# EAGLE design MaUWB DSTO v1.0 (EAGLE 6.1)
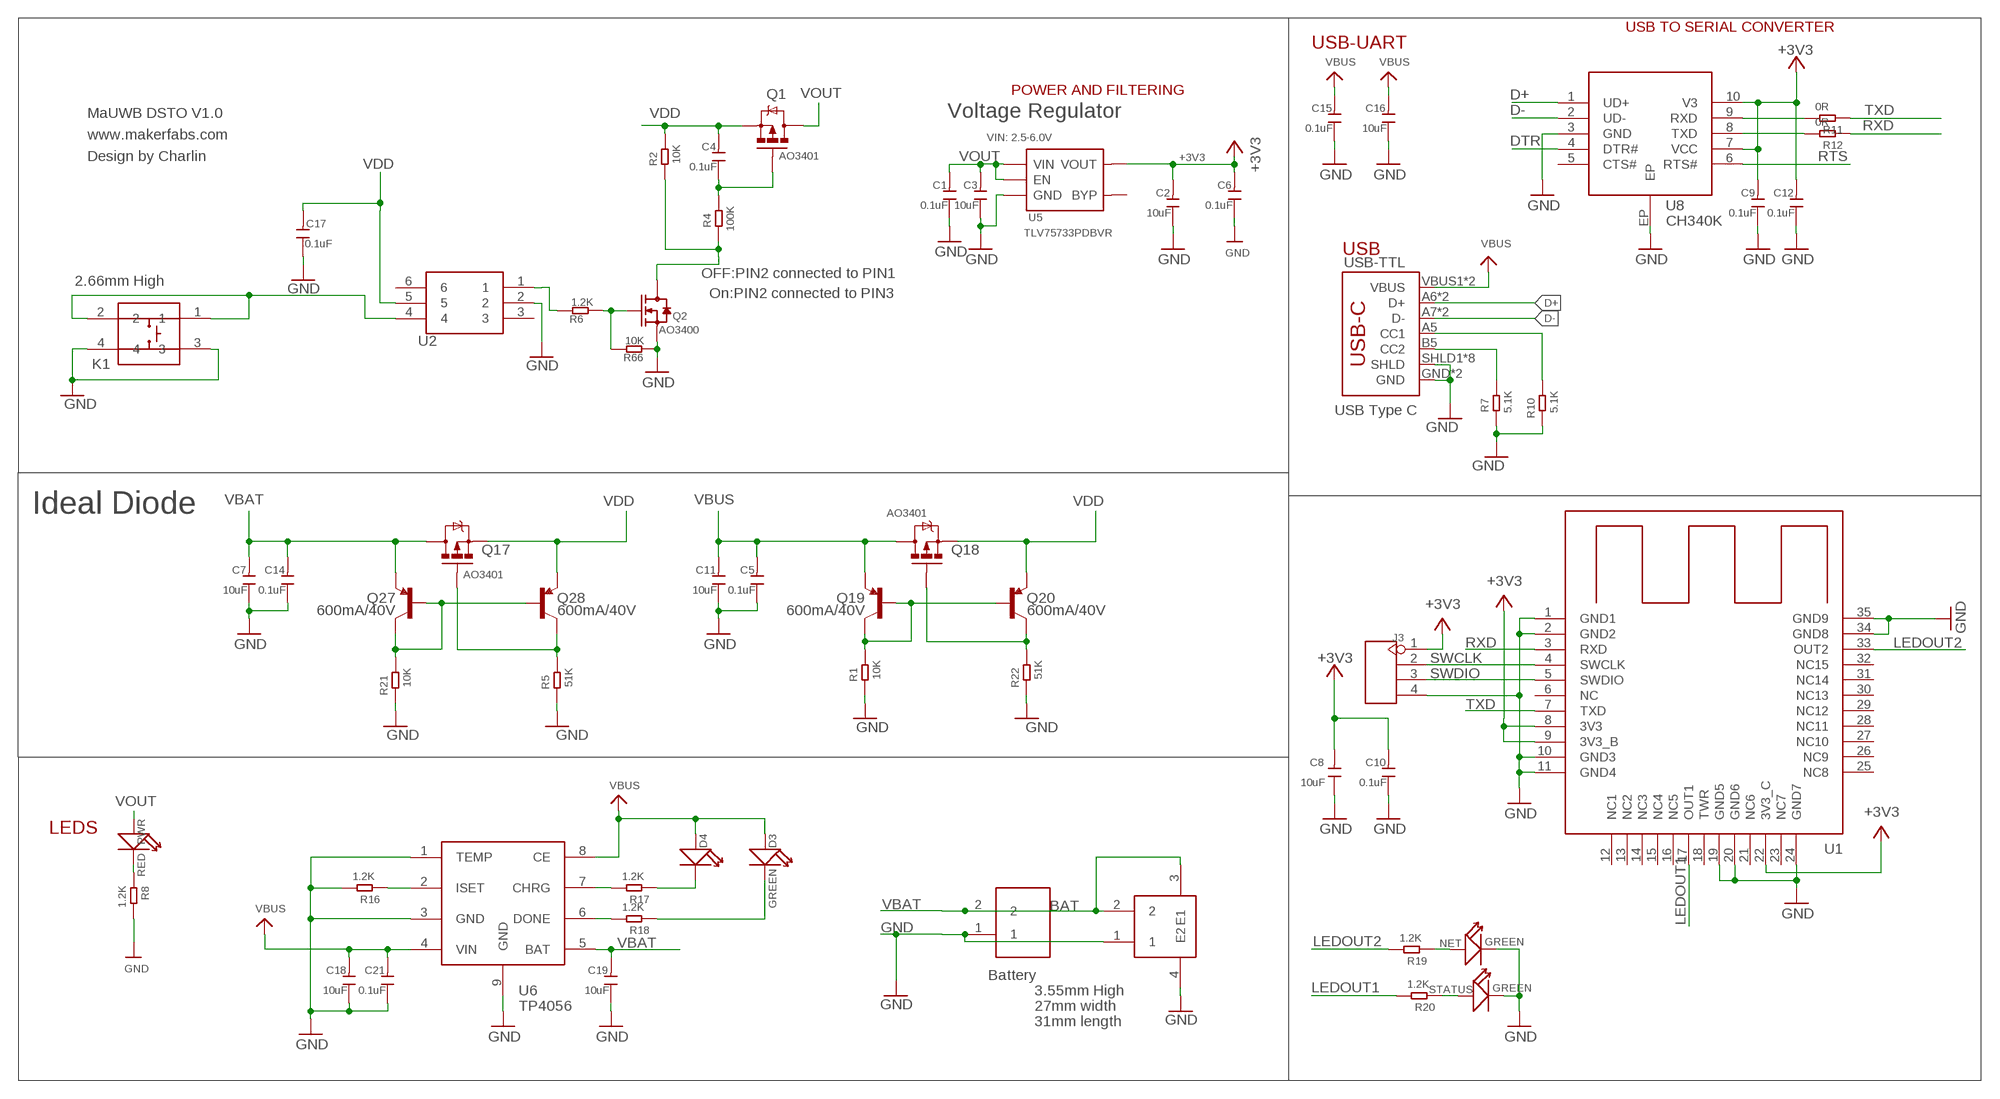
[diagram p0: schematic, sheet 1]

## Parts
BAT  PH2.0-2P-90-DIP  [PH2.0-2P-90-DIP]
C1  0.1uF  DISCRETE_C-0402  [DISCRETE_C0402]
C2  10uF  DISCRETE_C-0402  [DISCRETE_C0402]
C3  10uF  DISCRETE_C-0402  [DISCRETE_C0402]
C4  0.1uF  DISCRETE_C-0402  [DISCRETE_C0402]
C5  0.1uF  DISCRETE_C-0402  [DISCRETE_C0402]
C6  0.1uF  DISCRETE_C-0402  [DISCRETE_C0402]
C7  10uF  DISCRETE_C-0402  [DISCRETE_C0402]
C8  10uF  DISCRETE_C-0402  [DISCRETE_C0402]
C9  0.1uF  DISCRETE_C-0402  [DISCRETE_C0402]
C10  0.1uF  DISCRETE_C-0402  [DISCRETE_C0402]
C11  10uF  DISCRETE_C-0402  [DISCRETE_C0402]
C12  0.1uF  DISCRETE_C-0402  [DISCRETE_C0402]
C14  0.1uF  DISCRETE_C-0402  [DISCRETE_C0402]
C15  0.1uF  DISCRETE_C-0402  [DISCRETE_C0402]
C16  10uF  DISCRETE_C-0402  [DISCRETE_C0402]
C17  0.1uF  DISCRETE_C-0402  [DISCRETE_C0402]
C18  10uF  DISCRETE_C-0402  [DISCRETE_C0402]
C19  10uF  DISCRETE_C-0402  [DISCRETE_C0402]
C21  0.1uF  DISCRETE_C-0402  [DISCRETE_C0402]
D3  GREEN  DISCRETE_LED0603  [DISCRETE_LED-0603]
D4  DISCRETE_LED0603  [DISCRETE_LED-0603]
J2  JST-ACH1.2-2P  [A1203WRS-2P]
J3  HEADER-4P-60/35MILROUND  [4P-65/35ROUND]
K1  BTN01A  [BTN01A]
NET  GREEN  DISCRETE_LED0603  [DISCRETE_LED-0603]
PWR  RED  DISCRETE_LED0603  [DISCRETE_LED-0603]
Q1  AO3401  MOSFET-PCHANNEL  [SOT23-3]
Q2  AO3400  MOSFET-N'SOT23'  [SOT23@1]
Q17  AO3401  MOSFET-PCHANNEL  [SOT23-3]
Q18  AO3401  MOSFET-PCHANNEL  [SOT23-3]
Q19  600mA/40V  TRANS_PNP-MMBT4403  [SOT23-3]
Q20  600mA/40V  TRANS_PNP-MMBT4403  [SOT23-3]
Q27  600mA/40V  TRANS_PNP-MMBT4403  [SOT23-3]
Q28  600mA/40V  TRANS_PNP-MMBT4403  [SOT23-3]
R1  10K  DISCRETE_R-0402  [DISCRETE_R0402]
R2  10K  DISCRETE_R-0402  [DISCRETE_R0402]
R4  100K  DISCRETE_R-0402  [DISCRETE_R0402]
R5  51K  DISCRETE_R-0402  [DISCRETE_R0402]
R6  1.2K  DISCRETE_R-0402  [DISCRETE_R0402]
R7  5.1K  DISCRETE_R-0402  [DISCRETE_R0402]
R8  1.2K  DISCRETE_R-0402  [DISCRETE_R0402]
R10  5.1K  DISCRETE_R-0402  [DISCRETE_R0402]
R11  0R  DISCRETE_R-0402  [DISCRETE_R0402]
R12  0R  DISCRETE_R-0402  [DISCRETE_R0402]
R16  1.2K  DISCRETE_R-0402  [DISCRETE_R0402]
R17  1.2K  DISCRETE_R-0402  [DISCRETE_R0402]
R18  1.2K  DISCRETE_R-0402  [DISCRETE_R0402]
R19  1.2K  DISCRETE_R-0402  [DISCRETE_R0402]
R20  1.2K  DISCRETE_R-0402  [DISCRETE_R0402]
R21  10K  DISCRETE_R-0402  [DISCRETE_R0402]
R22  51K  DISCRETE_R-0402  [DISCRETE_R0402]
R66  10K  DISCRETE_R-0402  [DISCRETE_R0402]
STATUS  GREEN  DISCRETE_LED0603  [DISCRETE_LED-0603]
U1  UWB-DSTO  [UWB-DSTO]
U2  SW01A  [SOT23-6-95P-300L300W]
U5  TLV75733PDBVR  SPX3819  [SOT23-5]
U6  TP4056  [SOP8-1.27P]
U8  CH340K  [ESOP-10-EP-150MIL]
USB-TTL  USB_C5  [USB-C-16P-5]

## Nets
+3V3: C2.2 C6.2 C8.2 C9.2 C10.2 C12.2 J3.1 U1.8(3V3) U1.9(3V3_B) U1.22(3V3_C) U5.5(VOUT) U8.7(VCC) U8.10(V3)
D+: U8.1(UD+) USB-TTL.A6(D+) USB-TTL.B6(D+)
D-: U8.2(UD-) USB-TTL.A7(D-) USB-TTL.B7(D-)
DTR: U8.4(DTR#)
GND: BAT.1 C1.1 C2.1 C3.1 C5.1 C6.1 C7.1 C8.1 C9.1 C10.1 C11.1 C12.1 C14.1 C15.1 C16.1 C17.1 C18.1 C19.1 C21.1 J2.1 J2.4(E2) J3.4 K1.3 K1.4 NET.- Q2.2(S) R1.1 R5.1 R7.1 R8.2 R10.1 R16.2 R21.1 R22.1 R66.1 STATUS.- U1.1(GND1) U1.2(GND2) U1.10(GND3) U1.11(GND4) U1.19(GND5) U1.20(GND6) U1.24(GND7) U1.34(GND8) U1.35(GND9) U2.2 U5.2(GND) U6.1(TEMP) U6.3(GND) U6.9(GND) U8.3(GND) U8.EP USB-TTL.GND USB-TTL.GND2(GND) USB-TTL.SHLD1(SHLD) USB-TTL.SHLD2(SHLD) USB-TTL.SHLD3(SHLD) USB-TTL.SHLD4(SHLD) USB-TTL.SHLD5(SHLD) USB-TTL.SHLD6(SHLD) USB-TTL.SHLD7(SHLD) USB-TTL.SHLD8(SHLD)
LEDOUT1: R20.2 U1.17(OUT1)
LEDOUT2: R19.2 U1.33(OUT2)
N$1: NET.+ R19.1
N$2: Q19.1(B) Q19.3(C) Q20.1(B) R1.2
N$3: Q18.1(G) Q20.3(C) R22.2
N$4: C4.1 Q1.1(G) R4.2
N$5: PWR.- R8.1
N$6: Q2.3(D) R2.1 R4.1
N$7: K1.1 K1.2 U2.4
N$8: R6.2 U2.1
N$9: R7.2 USB-TTL.B5(CC2)
N$15: R10.2 USB-TTL.A5(CC1)
N$18: R20.1 STATUS.+
N$22: Q2.1(G) R6.1 R66.2
N$23: R16.1 U6.2(ISET)
N$29: R17.2 U6.7(CHRG)
N$30: R18.2 U6.6(DONE)
N$31: D4.- R17.1
N$32: D3.- R18.1
N$36: R11.2 U8.9(RXD)
N$37: R12.2 U8.8(TXD)
N$100: Q17.1(G) Q28.3(C) R5.2
N$110: Q27.1(B) Q27.3(C) Q28.1(B) R21.2
RTS: U8.6(RTS#)
RXD: R12.1 U1.3(RXD)
SWCLK: J3.2 U1.4(SWCLK)
SWDIO: J3.3 U1.5(SWDIO)
TXD: R11.1 U1.7(TXD)
VBAT: BAT.2 C7.2 C14.2 C19.2 J2.2 J2.3(E1) Q17.3(D) Q27.2(E) U6.5(BAT)
VBUS: C5.2 C11.2 C15.2 C16.2 C18.2 C21.2 D3.+ D4.+ Q18.3(D) Q19.2(E) U6.4(VIN) U6.8(CE) USB-TTL.VBUS1(VBUS) USB-TTL.VBUS2(VBUS)
VDD: C4.2 C17.2 Q1.2(S) Q17.2(S) Q18.2(S) Q20.2(E) Q28.2(E) R2.2 U2.5
VOUT: C1.2 C3.2 PWR.+ Q1.3(D) U5.1(VIN) U5.3(EN)
Unconnected: U1.6(NC) U1.12(NC1) U1.13(NC2) U1.14(NC3) U1.15(NC4) U1.16(NC5) U1.18(TWR) U1.21(NC6) U1.23(NC7) U1.25(NC8) U1.26(NC9) U1.27(NC10) U1.28(NC11) U1.29(NC12) U1.30(NC13) U1.31(NC14) U1.32(NC15) U2.3 U2.6 U5.4(BYP) U8.5(CTS#)

## Notes on the sheet
- USB TO SERIAL CONVERTER
- USB-UART
- POWER AND FILTERING
- Voltage Regulator
- MaUWB DSTO V1.0
- www.makerfabs.com | VIN: 2.5-6.0V
- Design by Charlin
- USB
- OFF:PIN2 connected to PIN1
- 2.66mm High
- On:PIN2 connected to PIN3
- USB Type C
- Ideal Diode
- LEDS
- BAT
- Battery
- 3.55mm High
- 27mm width
- 31mm length

## Library data of the parts
BAT = Connector:PH2.0-2P-90-DIP
C1-C12 C14-C19 C21 = A9G:DISCRETE_C*: Ceramic Capacitors
D3 D4 NET PWR STATUS = A9G:DISCRETE_LED*
J2 = user:JST-ACH1.2-2P
J3 = Connector:HEADER-4P
K1 = user:BTN01A
Q1 Q17 Q18 = User-Submitted:MOSFET-PCHANNEL: Generic PMOSFET IRLML2244 - TRANS-11153 (SOT-23 -20V -4.3A) (1.Gate 2.Source 3.Drain) FQP27P06 - COM-10349 <http://www.sparkfun.com/products/10349> (TO-220 -60V -27A) (1.Gate 2.Source 3.Drain); PROD_ID: TRANS-08285
Q2 = Discrete:MOSFET-N: IRLL014: http://www.vishay.com/docs/91319/sihll014.pdf
Q19 Q20 Q27 Q28 = SparkFun-DiscreteSemi:TRANS_PNP: PNP transistor Current controlled devices typically used to amplify current or used as a switch. SparkFun Products: SparkFun Serial Enabled 16x2 LCD - Red on Black <https://www.sparkfun.com/products/9068> SparkFun Logomatic <https://www.sparkfun.com/products/12772>; PROD_ID: TRANS-09245
R1 R2 R4-R8 R10-R12 R16-R22 R66 = A9G:DISCRETE_R*
U1 = user:UWB-DSTO
U2 = user:SW01A
U5 = IC:SPX3819
U6 = self:TP4056
U8 = sale:CH340K
USB-TTL = USBC:USB_C: USB Type C 16Pin Connector Super Speed pins not available on the 16-pin purely SMD connector so this part is best for USB 2.0 implementations. D1 and D2 are tied together enabling D+/- no matter which way the cable is plugged into the connector. The two channel configuration pins (CC1/2) are exposed. These are normally connected to ground via 5.1k resistors but can be reconfigured for high current/high power applications.

## Net classes
0 default: width 0.203 mm, drill 0.305 mm, clearance 0.152 mm

## Board
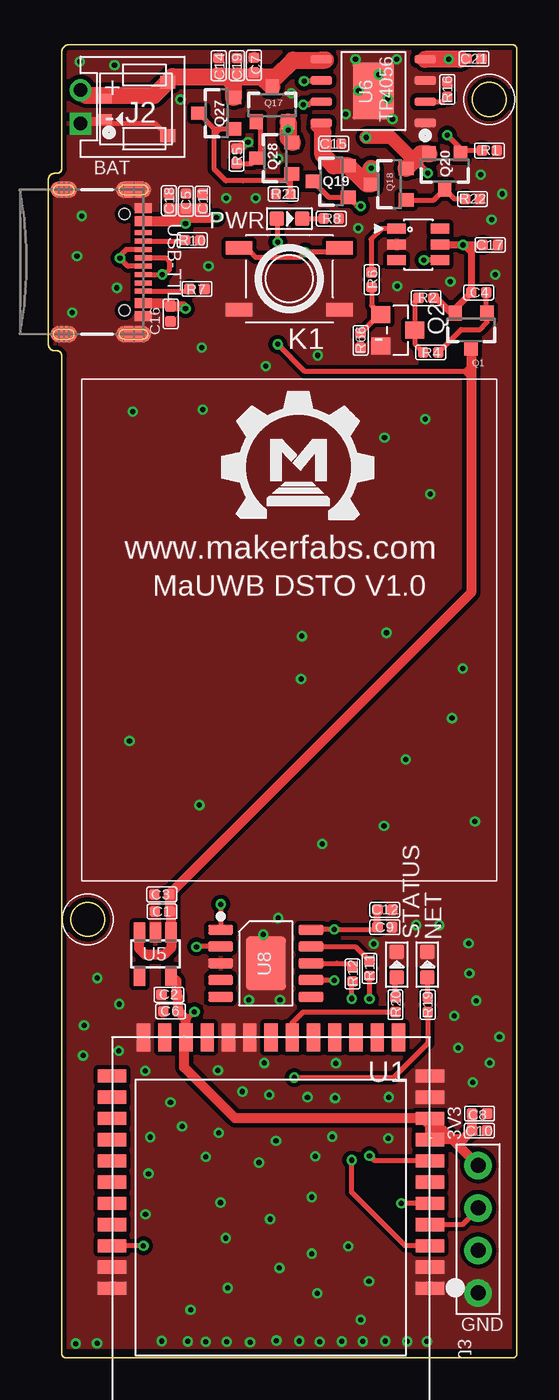
[diagram p1: board, top side]
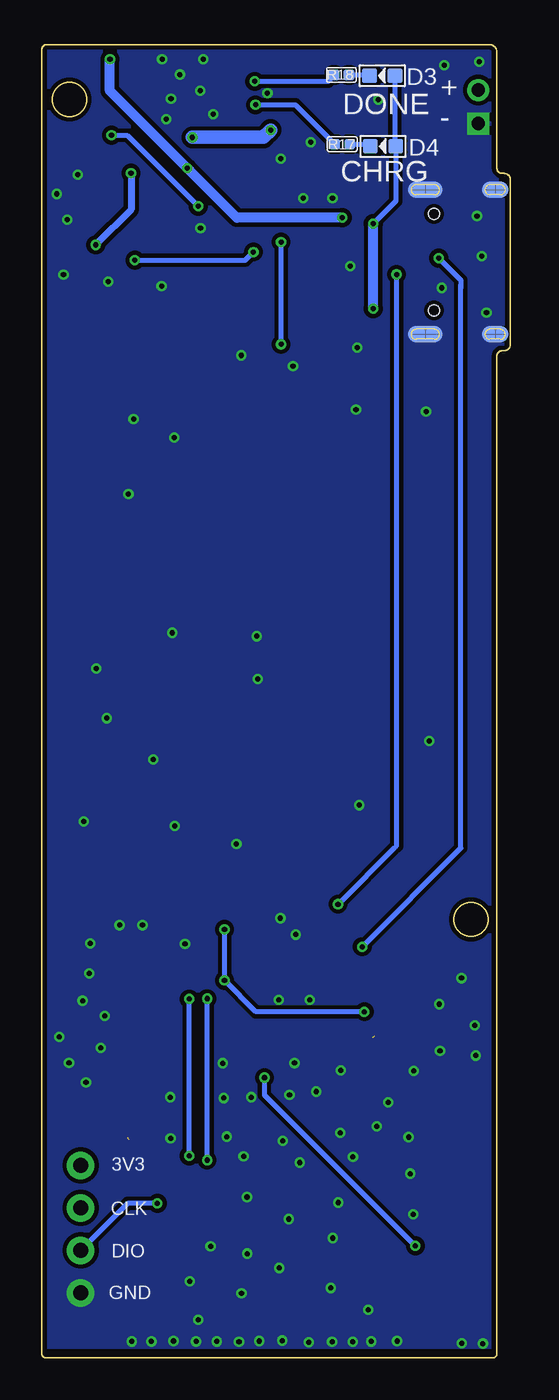
[diagram p2: board, bottom side, seen from below]

Size 28 x 78.5 mm. Coordinates in mm from the lower left corner, seen from the top.
Outline: 27.78,0 1.02,0 arc-90 0.8,0.22 0.8,59.9 arc90 0.5,60.2 0.36,60.2 arc-90 0,60.56 0,70.44 arc-90 0.36,70.8 0.5,70.8 arc90 0.8,71.1 0.8,78.05 arc-90 1.25,78.5 27.72,78.5 arc-90 28,78.22 28,0.22 arc-90 27.78,0
Outline: circle at 2.35,26.2 radius 1
Outline: circle at 26.35,75.22 radius 1
Copper layers (1*16): Top 0.035mm / dielectric 1.5mm / Bottom 0.035mm
Design rules: minimum track width 10mil, minimum drill 10mil, track to track 8mil, track to pad 8mil, pad to pad 8mil, via to via 8mil, smd to smd 0mil, copper to edge 10mil, drill to drill 8mil, minimum pad ring 10mil, minimum via ring 6mil, stop-mask expansion 4mil, vias tented up to drill 100mil, thermal gap 0mil
tRestrict: area 0.8,-11 to 28.8,0.3
bRestrict: area 0.5,-11.5 to 28.5,0.3

### Footprints (pad centres in the part's own frame; a part is rotated, then mirrored left to right if it is on the bottom)
PH2.0-2P-90-DIP = drill 0.8 square: 1 0,1 | drill 0.8: 2 0,-1
DISCRETE_C0402 = smd 0.635 x 0.635: 1 -0.445,0; 2 0.445,0
DISCRETE_LED-0603 = smd 0.889 x 0.889: + -0.762,0; - 0.762,0
A1203WRS-2P = smd 0.6 x 0.9: 1 -0.6,1.9; 2 0.6,1.9 | smd 0.8 x 0.9: 3 1.6,-1.9; 4 -1.6,-1.9
4P-65/35ROUND = drill 0.889 pad 1.651: 1 0,3.81; 2 0,1.27; 3 0,-1.27; 4 0,-3.81
BTN01A = smd 1.58 x 0.8: 1 -3,1.85; 2 3,1.85; 3 -3,-1.85; 4 3,-1.85
SOT23-3 = smd 0.8 x 0.9: 1 -0.95,-1; 2 0.95,-1; 3 0,1.1
SOT23@1 = smd 1.016 x 1.143: 1 -0.95,-1.016; 2 0.95,-1.016; 3 0,1.016
DISCRETE_R0402 = smd 0.635 x 0.635: 1 -0.445,0; 2 0.445,0
UWB-DSTO = smd 0.8 x 1.7: 1 -15,0; 2 -13.73,0; 3 -12.46,0; 4 -11.19,0; 5 -9.92,0; 6 -8.65,0; 7 -7.38,0; 8 -6.11,0; 9 -4.84,0; 10 -3.57,0; 11 -2.3,0; 25 -2.3,19; 26 -3.57,19; 27 -4.84,19; 28 -6.11,19; 29 -7.38,19; 30 -8.65,19; 31 -9.92,19; 32 -11.19,19; 33 -12.46,19; 34 -13.73,19; 35 -15,19 | smd 1.7 x 0.8: 12 0,1.88; 13 0,3.15; 14 0,4.42; 15 0,5.69; 16 0,6.96; 17 0,8.23; 18 0,9.5; 19 0,10.77; 20 0,12.04; 21 0,13.31; 22 0,14.58; 23 0,15.85; 24 0,17.12
SOT23-6-95P-300L300W = smd 1.1 x 0.6: 1 -1.3,0.95; 2 -1.3,0; 3 -1.3,-0.95; 4 1.3,-0.95; 5 1.3,0; 6 1.3,0.95
SOT23-5 = smd 0.69 x 1.2: 1 -0.95,-1.3; 2 0,-1.3; 3 0.95,-1.3; 4 0.95,1.3; 5 -0.95,1.3
SOP8-1.27P = smd 1.27 x 0.51: 1 -3.1,1.905; 2 -3.1,0.635; 3 -3.1,-0.635; 4 -3.1,-1.905; 5 3.1,-1.905; 6 3.1,-0.635; 7 3.1,0.635; 8 3.1,1.905 | smd 2.5 x 3.4: 9 0,0
ESOP-10-EP-150MIL = smd 1.5 x 0.6: 1 -2.7,2; 2 -2.7,1; 3 -2.7,0; 4 -2.7,-1; 5 -2.7,-2; 6 2.7,-2; 7 2.7,-1; 8 2.7,0; 9 2.7,1; 10 2.7,2 | smd 2.4 x 3.2: EP 0,0
USB-C-16P-5 = smd 0.3 x 1: A5 -1.25,-0.34; A6 -0.25,-0.34; A7 0.25,-0.34; A8 1.25,-0.34; B5 1.75,-0.34; B6 0.75,-0.34; B7 -0.75,-0.34; B8 -1.75,-0.34 | smd 0.6 x 1: GND -3.225,-0.34; GND2 3.225,-0.34; VBUS1 -2.45,-0.34; VBUS2 2.45,-0.34 | smd 1 x 2.1: SHLD1 -4.32,-0.915; SHLD2 4.32,-0.915 | smd 1 x 2.1 bottom: SHLD3 -4.32,-0.915; SHLD4 4.32,-0.915 | smd 1 x 1.6: SHLD5 -4.32,-5.095; SHLD8 4.32,-5.095 | smd 1 x 1.6 bottom: SHLD6 -4.32,-5.095; SHLD7 4.32,-5.095 | hole 0.65: -2.89,-1.445; 2.89,-1.445

### Placement (x,y rotation side)
BAT  1.92,74.78 180 top
C1  6.79,26.68 0 top
C2  7.2,21.7 0 top
C3  6.77,27.69 0 top
C4  25.72,63.68 180 top
C5  8.22,69.14 270 top
C6  7.3,20.71 0 top
C7  12.28,77.27 270 top
C8  25.76,14.59 180 top
C9  20.1,25.74 180 top
C10  25.75,13.58 180 top
C11  9.21,69.14 270 top
C12  20.1,26.78 180 top
C14  10.17,77.25 270 top
C15  17.06,72.57 180 top
C16  7.3,62.4 90 top
C17  26.4,66.53 180 top
C18  7.2,69.17 270 top
C19  11.26,77.25 270 top
C21  25.44,77.65 180 top
D3  7.66,76.64 180 bottom
D4  7.61,72.42 180 bottom
J2  5.22,74.66 90 top
J3  25.68,7.68 0 top
K1  14.4,64.5 0 top
NET  22.64,23.5 90 top
PWR  14.4,68.1 0 top
Q1  25.26,61.45 180 top
Q2  20.87,61.42 270 top
Q17  13.37,74.88 0 top
Q18  20.38,70.16 90 top
Q19  16.93,70.31 90 top
Q20  23.69,70.97 180 top
Q27  10.07,74.4 90 top
Q28  13.55,71.71 90 top
R1  26.35,72.17 180 top
R2  22.57,63.35 0 top
R4  22.85,60.1 0 top
R5  11.24,71.84 270 top
R6  19.32,64.44 90 top
R7  8.88,63.9 180 top
R8  16.9,68.1 0 top
R10  8.6,66.81 180 top
R11  19.19,23.27 90 top
R12  18.17,22.94 90 top
R16  23.84,75.82 90 top
R17  10.05,72.55 180 bottom
R18  10.1,76.69 180 bottom
R19  22.67,21.1 270 top
R20  20.74,21.1 270 top
R21  14.03,69.58 0 top
R22  25.34,69.27 180 top
R66  18.66,60.81 90 top
STATUS  20.82,23.5 90 top
U1  22.8,19.15 90 top
U2  22.11,66.55 0 top
U5  6.39,24.14 180 top
U6  19.42,75.72 180 top
U8  12.99,23.58 0 top
U$1  [MAKERFABS_0.3]  10.82,50.16 0 top
USB-TTL  6,65.5 270 top

### Tracks (layer width: path | path; a pad name or v marks a point on that pad's centre or on a via)
+3V3  (via drill 0.3)  (2 unrouted)
  Top 0.305: U8.7 17.07,22.58 v17.08,22.56 | U8.10 15.72,25.61 v17.08,25.61 19.53,25.61 C9.2 | 8.22,20.23 8.28,20.23 v8.72,20.68
  Top 0.406: U8.10 15.74,25.53 15.84,25.53 | C9.2 C12.2
  Top 0.61: U1.22 8.22,20.23 C6.2 7.75,21.59 C2.2 7.64,22.53 U5.5 | 8.24,19.36 8.12,19.23 8.12,17.35 11.16,14.31 U1.9 22.8,13.26 22.9,13.16 22.9,13.64 | 22.9,13.64 22.9,13.77 22.64,14.03 23.03,14.03 23.13,14.13 | J3.1 23.53,13.64 22.9,13.64 | U1.8 24.77,13.04 C10.2 25.31,14.58 C8.2
  Bottom 0.305: v17.08,25.61 v17.08,22.56 15.2,20.68 v8.72,20.68
D+  (via drill 0.3)
  Top 0.305: v10.3,27.11 U8.1 | USB-TTL.A6 7.01,65.75 7.23,65.54 7.23,65.04 6.94,64.75 | USB-TTL.B6 6.74,64.75 | 6.74,64.75 6.94,64.75 | 6.94,64.75 v6.8,64.76 6.73,64.76 6.74,64.75 | 6.94,64.75 6.74,64.75
  Bottom 0.305: v10.3,27.11 6.95,30.46 6.8,30.61 v6.8,64.76
D-  (via drill 0.3)
  Top 0.305: U8.2 v8.86,24.58 v8.85,24.57 | USB-TTL.B7 4.64,66.25 4.25,65.87 4.25,65.74 v4.28,65.74 4.28,65.72 4.75,65.25 USB-TTL.A7
  Bottom 0.305: v8.85,24.57 2.96,30.46 2.96,63.96 | 2.96,63.96 2.96,64.14 | v4.28,65.74 2.96,64.42 2.96,63.96
GND  (via drill 0.3)
  Top 0.305: J2.4 6.39,73.78 BAT.1 1.93,73.79 1.97,73.79 2.02,73.84 2.17,73.84 2.38,74.06 J2.1 | R5.1 11.56,72.28 11.9,72.62 11.6,72.62 11.32,72.34 11.54,72.34 11.93,72.72 11.95,72.72 11.93,72.7 v11.93,72.67
  other vias: 13.8,5.36 9.16,60.38 16.37,30.71 26.71,64.75 15.1,40.57 24.12,38.23 21.35,35.77 25.49,32.06 24.75,41.2 20.05,31.78 15.15,43.13 12.99,59.29 20.21,43.34 10.73,4.17 12.59,11.66 15.48,15.58 22.52,56.11 16.09,59.92 1.87,77.47 13.73,71.68 3.95,77.27 1.99,68.25 27.11,69.58 1.64,0.84 2.91,0.87 6.77,1 8.32,0.97 9.41,0.94 10.66,0.94 12.05,0.92 13.63,1.02 15,1 16.22,0.94 17.54,0.97 18.78,0.97 20.13,1 21.45,0.97 22.62,0.97 18.66,2.27 19.44,24.74 10.63,69.32 12.38,69.32 18.35,77.63 20.82,77.63 17.76,74.35 20.56,74.05 18.53,75.75 19.75,76.71 20.28,75.27 13.74,26.27 12.83,25.29 11.98,21.39 13.84,21.38 10.13,17.18 2.92,22.69 2.13,19.86 4.24,21.13 9.41,12 12.9,17.61 15.74,9.6 10.61,7.15 17.91,6.66 10.28,9.27 8.49,2.86 13.24,8.28 13.2,15.71 16.07,3.85 7.3,15.27 15.94,12.05 19.16,4.57 15.73,6.22 26.95,19.17 24.48,18.52 9.02,33.03 4.84,36.87 5.03,56.56 9.22,56.68 22.82,51.63 20.84,64.06 24.02,64.33 26.48,68.03 25.84,70.72 18.51,67.52 9.56,65.25 1.7,65.85 1.42,62.47 4.09,63.95 20.08,55.01 7.89,75.22 14.52,75.6 17.13,15.52 17.18,17.61 21.98,25.86 23.36,25.86 25.11,24.77 25.16,22.97 24.24,20.43 25.57,21.34 25.36,16.46 26.38,17.63 20.33,15.58 20.31,13.11 16.95,13.21 13.6,12.96 10.17,13.44 6.08,13.19 5.8,8.56 5.98,11 7.99,13.82 11.6,15.91 5.78,17.15 4.2,18.34 2.07,18.06
  pour Top (isolate 0.254, rank 6): -7.71,83.5 30.8,83.5 30.8,0.26 -7.72,0.26 -7.72,60.86
  pour Bottom (isolate 0.254, rank 6): -1.49,83.5 31.8,83.5 31.8,0.26 -1.49,0.26
LEDOUT1
  Top 0.305: R20.2 15.2,20.66 14.57,20.02 U1.17
LEDOUT2  (via drill 0.3)
  Top 0.305: R19.2 22.67,18.8 20.61,16.74 v14.69,16.74 | v5.68,6.68 U1.33
  Bottom 0.305: v14.69,16.74 14.69,15.7 v5.68,6.68
N$1
  Top 0.305: R19.1 22.67,22.71 NET.+
N$2  (via drill 0.3)
  Top 0.305: Q19.3 16.78,69.36 Q19.1 18.45,68.84 v18.66,68.84 | R1.2 24.83,72.17 Q20.1 24.64,72.28 v23.84,73.08
  Bottom 0.305: v23.84,73.08 22.9,73.08 v18.66,68.84
N$3
  Top 0.305: Q18.1 23.02,69.21 Q20.3 | R22.2 24.27,69.27 23.71,69.83
  Top 0.406: 23.71,69.83 23.71,69.85 Q20.3
N$4
  Top 0.305: C4.1 26.16,62.5 Q1.1 26.21,61.89 25.79,61.47 24.66,61.47 R4.2
N$5
  Top 0.305: PWR.- R8.1
N$6
  Top 0.305: R4.1 21.91,60.6 21.91,61.42 | 21.91,61.42 21.91,61.5 | R2.1 21.88,63.11 Q2.3 21.91,61.42
N$7  (via drill 0.3)
  Top 0.305: U2.4 v22.45,65.6 v22.44,65.61 | K1.1 arc90 11.65,66.1 11.69,66.14 12.02,66.14 12.37,65.79 14.7,65.79 15.04,65.79 v15.35,66.1 17.15,66.1 K1.2
  Bottom 0.305: v22.44,65.61 16.09,65.61 15.85,65.61 v15.36,66.1 v15.35,66.1
N$8
  Top 0.305: U2.1 19.94,67.5 19.29,66.86 19.29,64.91 R6.2
N$9
  Top 0.305: USB-TTL.B5 8.43,63.75 R7.2
N$15
  Top 0.305: 7.98,66.97 8.17,66.78 8.15,66.79 R10.2 8.14,66.79 8.14,66.78 8.11,66.75 USB-TTL.A5
N$18
  Top 0.305: R20.1 20.74,22.66 STATUS.+
N$22
  Top 0.305: R6.1 19.32,62.91 Q2.1 19.77,62.37 R66.2
N$23
  Top 0.305: U6.2 23.55,75.09 R16.1
N$29  (via drill 0.3)
  Top 0.305: U6.7 arc-90 16.3,75.07 15.73,75.07 15.56,74.9 v15.23,74.9
  Bottom 0.305: v15.23,74.9 12.84,74.9 R17.2
N$30  (via drill 0.3)
  Top 0.305: U6.6 16.32,76.31 v15.28,76.31
  Bottom 0.305: v15.28,76.31 10.88,76.31 10.68,76.51 | 10.68,76.51 10.53,76.66 | R18.2 10.54,76.65 10.68,76.51
N$31
  Bottom 0.305: R17.1 8.5,72.55 D4.-
N$32
  Bottom 0.305: R18.1 8.47,76.69 D3.-
N$36
  Top 0.305: U8.9 18.33,24.58 R11.2
N$37
  Top 0.305: U8.8 17.25,23.58 18.17,23.58 R12.2
N$100
  Top 0.305: R5.2 12.17,71.39 12.46,71.68 12.45,71.69 Q28.3 12.45,71.77 12.43,71.78 12.42,71.8 12.46,71.76 12.66,71.76 | Q17.1 12.66,73.65 12.66,71.76 | 12.66,71.76 12.66,71.73 12.66,71.76
N$110
  Top 0.305: Q27.1 10.05,73.45 | 10.05,73.45 9.95,73.45 8.98,74.43 8.97,74.42 Q27.3 | R21.2 14.48,70.69 | 14.48,70.69 Q28.1 | 14.48,70.69 14.46,70.67 14.46,70.13 14.24,70.36 11.62,70.36 10.6,70.36 9.92,71.05 9.92,73.45 10.05,73.45 | 9.97,73.16 10.25,73.44 10.25,73.45 10.05,73.45
RXD  (via drill 0.3)
  Top 0.305: U1.3 21.32,6.69 18.12,9.89 v18.12,11.82 | v18.12,21.47 18.12,21.71 18.12,22.45 R12.1
  Bottom 0.305: v18.12,11.82 v18.12,21.47
SWCLK
  Top 0.305: U1.4 24.76,7.96 25.72,8.92 25.71,8.92 J3.2
SWDIO  (via drill 0.3)
  Top 0.305: U1.5 v21.1,9.23 v21.1,9.22
  Bottom 0.305: v21.1,9.22 22.87,9.22 J3.3
TXD  (via drill 0.3)
  Top 0.305: U1.7 21.04,11.77 19.49,11.77 v19.19,12.07 | v19.19,21.44 R11.1
  Bottom 0.305: v19.19,12.07 v19.19,21.44
VBAT
  Top 0.305: C14.2 10.59,76.8 10.81,76.59 11.05,76.59 C19.2 | 12.74,76.59 12.52,76.59 C7.2 | J2.2 3.71,75.26 3.92,75.47 | U6.5 16.32,77.58 | 7.07,76.23 7.09,76.23 J2.3
  Top 1.016: BAT.2 2.23,75.47 3.67,75.47 3.92,75.47 6.31,75.47 7.07,76.23 7.43,76.59 10.63,76.59 | 10.63,76.59 10.81,76.59 12.74,76.59 | 12.74,76.59 13.63,76.59 14.62,77.58 16.32,77.58 16.55,77.58 | Q17.3 12.74,76.59 | Q27.2 11.07,76.15 10.63,76.59
VBUS  (via drill 0.3)
  Top 0.305: C16.2 7.4,63.09 | 8.19,68.13 8.86,68.13 8.9,68.17
  Top 0.406: 16.4,73.26 16.17,73.26 15.86,73.56 16.06,73.56 U6.8 | 8.9,68.17 8.13,68.17 7.8,68.5 7.35,68.5 6.8,67.95 | 7.24,68.23 8.04,68.23 8.12,68.15 9.28,68.15 | 9.58,68.05 8.13,68.05 | 8.19,68.13 8.13,68.07 8.13,68.05 | 8.13,68.05 8.13,68.03 8.13,68.05
  Top 0.61: 8.9,68.17 9.13,68.17 | 9.13,68.17 9.28,68.17 9.28,68.15 v10.05,68.15 | v8.19,67.8 8.19,68.13 | v23.93,77.63 U6.4 | C21.2 24.62,77.65 | 8.34,68.7 C11.2 9.21,68.25 9.13,68.17 | 8.34,68.7 C5.2 | C5.2 7.23,68.7 C18.2 | C5.2 8.34,68.7 | 16.4,71.91 16.4,72.36 C15.2 | USB-TTL.VBUS2 7.3,63.05 C16.2 8.06,62.84 v8.19,62.72 | USB-TTL.VBUS1 6.8,67.95 8.25,67.95 8.8,68.5
  Top 1.016: 16.4,73.26 16.4,71.91 17.05,71.26 Q19.2 19.03,70.16 Q18.3 19.28,71.09 v19.3,71.11 | 24.62,77.65 24.6,77.63 U6.4
  Bottom 0.305: D3.+ 6.9,72.47 D4.+ 6.84,69.14 v8.19,67.8
  Bottom 0.406: v19.3,71.11 19.58,71.39
  Bottom 0.61: v10.05,68.15 16.34,68.15 19.19,71 v19.3,71.11 19.58,71.39 23.93,75.73 v23.93,77.63 | v8.19,62.72 v8.19,67.8
VDD  (via drill 0.3)
  Top 0.305: 14.32,72.87 14.62,72.57 | 14.32,72.87 14.34,72.87 Q28.2 | 14.32,72.87 v14.32,73.39 | C17.2 25.95,66.53 | 25.69,66.5 25.26,66.07 25.23,66.07 24.83,66.48 v24.78,66.53
  Top 0.406: U2.5 23.44,66.53 v24.78,66.53 | v24.78,66.53 25.03,66.53 | 25.03,66.53 25.29,66.53 | 25.29,66.53 25.95,66.53 | 25.29,66.53 25.29,65.99 25.29,63.68 C4.2 24.17,62.58 | 24.17,62.58 24.17,62.56 23.96,62.56 23.1,63.43 23.03,63.35 R2.2 | 24.17,62.58 24.18,62.58 Q1.2 | Q18.2 21.44,71.11 21.91,71.58 v22.67,70.82 | v24.78,66.53 25.03,66.53
  Top 0.813: Q18.2 21.41,71.11 21.86,71.56 20.46,72.95 v19,72.95 | v14.32,73.39 14.32,73.36
  Top 1.016: Q20.2 22.25,71.97 Q18.2 | Q17.2 v14.32,73.39 14.32,73.36 14.32,72.92 14.59,72.65
  Bottom 0.406: v22.67,70.82 22.67,68.64 v24.78,66.53
  Bottom 0.813: v19,72.95 14.76,72.95 v14.32,73.39
VOUT  (via drill 0.3)
  Top 0.305: Q1.3 25.26,58.96 24.88,58.96 | 24.88,58.96 15.33,58.96 v13.7,60.58 | v13.7,66.7 13.7,68.03 PWR.+ | 25.11,59.19 24.88,58.96 | 24.88,58.96 25.13,58.7
  Top 0.61: Q1.3 25.26,58.96 25.26,45.74 7.59,28.07 | 7.59,28.07 C3.2 arc-90 7.24,27.67 C1.2 | 7.59,28.07 7.34,27.82 U5.1 arc90 7.33,25.43 7.33,24.49 6.92,24.08 5.78,24.08 5.44,24.43 U5.3
  Bottom 0.305: v13.7,60.58 v13.7,66.7

### Text on the board
tPlace: + | - | - | www.makerfabs.com | MaUWB DSTO V1.0 | 3V3 | GND
bPlace: + | DONE | - | CHRG | 3V3 | CLK | DIO | GND